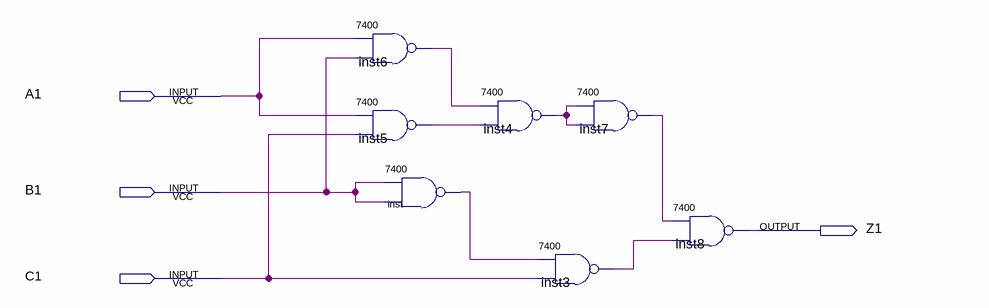
[diagram p0: schematic sheet]
// Quartus schematic Block2.bdf as structural Verilog: 7 symbols, 4 pins
module Block2 (
  input  A1,
  input  B1,
  input  C1,
  output Z1
);

  wire inst3_1, inst4_1, inst5_1, inst6_1, inst7_1, inst_1;

  \7400  inst6 (.\3 (B1), .\2 (A1), .\1 (inst6_1));
  \7400  inst5 (.\3 (C1), .\2 (A1), .\1 (inst5_1));
  \7400  inst (.\3 (B1), .\2 (B1), .\1 (inst_1));
  \7400  inst4 (.\3 (inst5_1), .\2 (inst6_1), .\1 (inst4_1));
  \7400  inst7 (.\3 (inst4_1), .\2 (inst4_1), .\1 (inst7_1));
  \7400  inst3 (.\3 (C1), .\2 (inst_1), .\1 (inst3_1));
  \7400  inst8 (.\3 (inst3_1), .\2 (inst7_1), .\1 (Z1));
endmodule
